# EAGLE design ir_receiver (EAGLE 7.4.0)
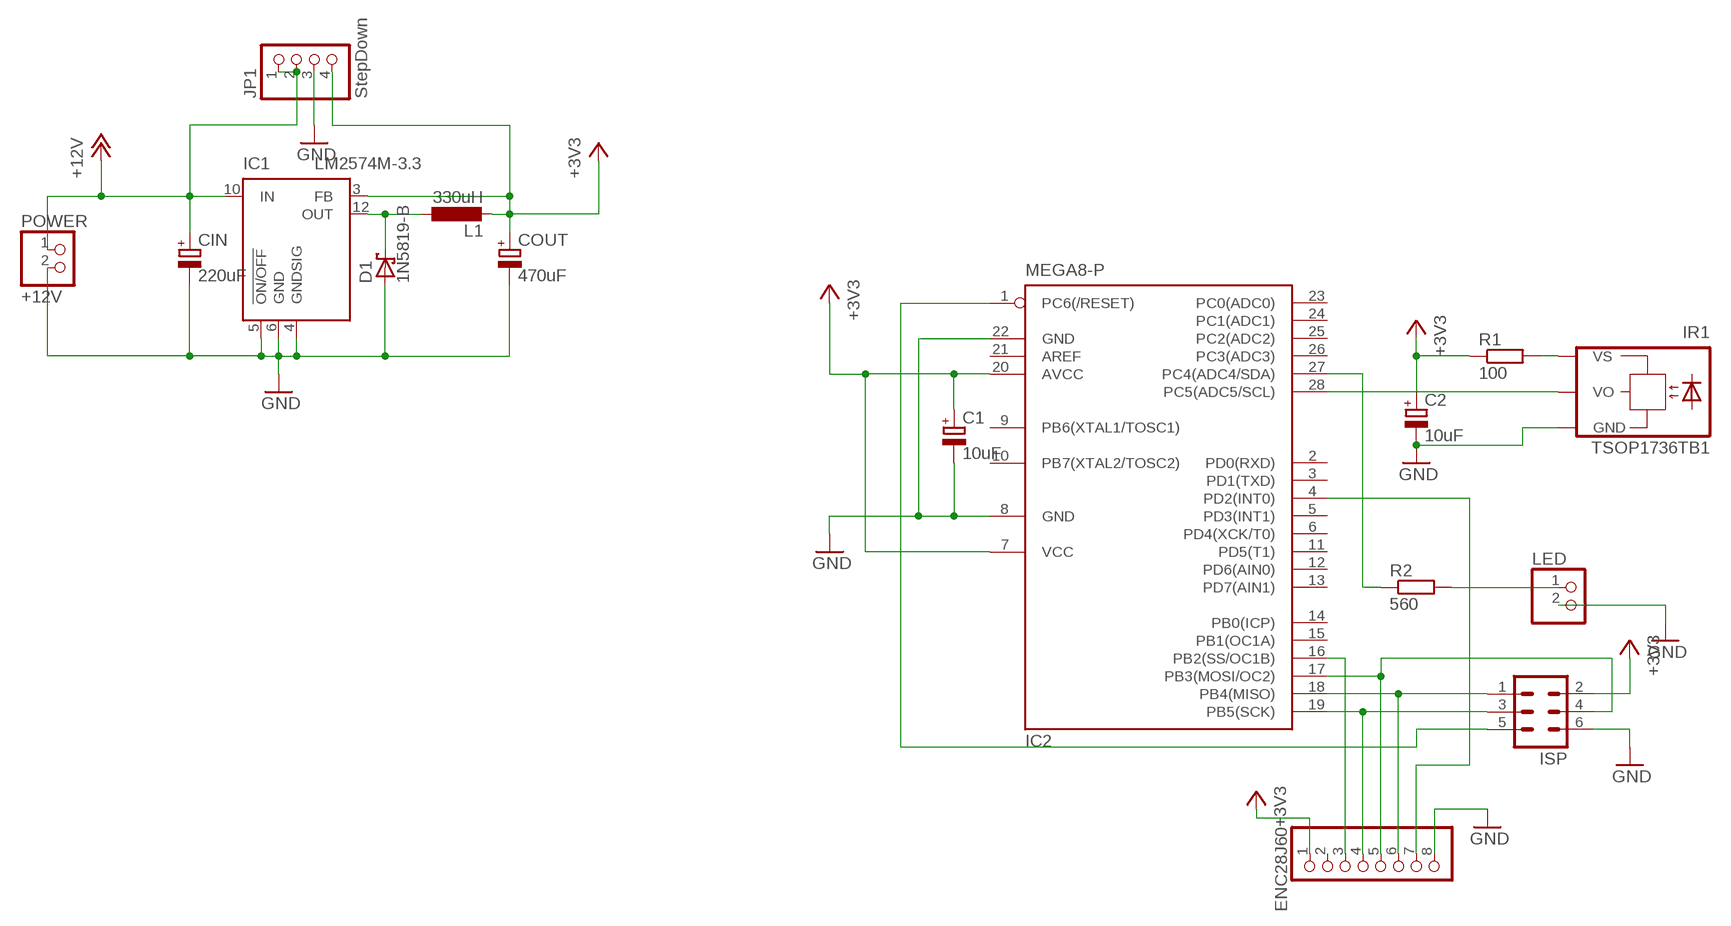
[diagram p0: schematic, sheet 1]

## Parts
C1  10uF  CPOL-EUE2.5-5  [E2,5-5]
C2  10uF  CPOL-EUE2.5-5  [E2,5-5]
CIN  220uF  CPOL-EUE3.5-8  [E3,5-8]
COUT  470uF  CPOL-EUE5-10.5  [E5-10,5]
D1  1N5819-B  [DO41-7.6]
ENC28J60  PINHD-1X8  [1X08]
IC1  LM2574M-3.3  [SO14W]
IC2  MEGA8-P  [DIL28-3]
IR1  TSOP1736TB1  [TSOP17_TB1]
ISP  ML6  [ML6]
JP1  StepDown  PINHD-1X4  [1X04]
L1  330uH  PIS4728  [PIS2816]
LED  PINHD-1X2  [1X02]
POWER  +12V  PINHD-1X2  [1X02]
R1  100  R-EU_0207/7  [0207/7]
R2  560  R-EU_0207/7  [0207/7]

## Nets
+3V3: C1.+ C2.+ COUT.+ ENC28J60.1 IC1.3(FB) IC2.7(VCC) IC2.20(AVCC) ISP.2 JP1.4 L1.2 R1.1
+12V: CIN.+ IC1.10(IN) JP1.1 JP1.2 POWER.1
GND: C1.- C2.- CIN.- COUT.- D1.A ENC28J60.8 IC1.4(GNDSIG) IC1.5(!ON/OFF) IC1.6(GND) IC2.8(GND) IC2.22(GND) IR1.GND ISP.6 JP1.3 LED.2 POWER.2
N$1: IC2.27(PC4(ADC4/SDA)) R2.1
N$2: IC2.28(PC5(ADC5/SCL)) IR1.VO
N$3: D1.C IC1.12(OUT) L1.1
N$4: LED.1 R2.2
N$5: IR1.VS R1.2
N$6: ENC28J60.4 IC2.19(PB5(SCK)) ISP.3
N$7: ENC28J60.5 IC2.17(PB3(MOSI/OC2)) ISP.4
N$8: ENC28J60.6 IC2.18(PB4(MISO)) ISP.1
N$9: IC2.1(PC6(/RESET)) ISP.5
N$10: ENC28J60.3 IC2.16(PB2(SS/OC1B))
N$11: ENC28J60.7 IC2.4(PD2(INT0))
Unconnected: ENC28J60.2 IC2.2(PD0(RXD)) IC2.3(PD1(TXD)) IC2.5(PD3(INT1)) IC2.6(PD4(XCK/T0)) IC2.9(PB6(XTAL1/TOSC1)) IC2.10(PB7(XTAL2/TOSC2)) IC2.11(PD5(T1)) IC2.12(PD6(AIN0)) IC2.13(PD7(AIN1)) IC2.14(PB0(ICP)) IC2.15(PB1(OC1A)) IC2.21(AREF) IC2.23(PC0(ADC0)) IC2.24(PC1(ADC1)) IC2.25(PC2(ADC2)) IC2.26(PC3(ADC3))

## Library data of the parts
C1 C2 CIN COUT = rcl:CPOL-EU: POLARIZED CAPACITOR, European symbol
D1 = diode:1N581*: 1.0A SCHOTTKY BARRIER RECTIFIER Source: http://www.diodes.com/datasheets/ds23001.pdf
ENC28J60 = pinhead:PINHD-1X8: PIN HEADER
IC1 = linear:LM2574?-*: SIMPLE SWITCHER 0.5A Step-Down Voltage Regulator Source: http://cache.national.com/ds/LM/LM2574.pdf
IC2 = atmel:MEGA8-P: MICROCONTROLLER 8 Kbytes FLASH, 1 kbytes SRAM, 512 bytes EEPROM, USART, 4-channel 10 bit ADC, 2-channel 8 bit ADC Pin compatible with Atmega48, ATMega88, ATMega168 Source: avr.lbr; OC_FARNELL: unknown; OC_NEWARK: unknown
IR1 = telefunken:TSOP17*TB1: TSOP17..TB1 IR Receiver Modules for Remote Control Systems Source: http://www.vishay.com/docs/82042/82042.pdf; OC_FARNELL: unknown; OC_NEWARK: unknown
ISP = con-ml:ML6: HARTING; OC_FARNELL: unknown; OC_NEWARK: unknown
JP1 = pinhead:PINHD-1X4: PIN HEADER
L1 = jbolay:PIS4728
LED POWER = pinhead:PINHD-1X2: PIN HEADER
R1 R2 = rcl:R-EU_: RESISTOR, European symbol

## Net classes
0 default: width 0.4 mm, drill 0.8 mm, clearance 0.254 mm

## Board
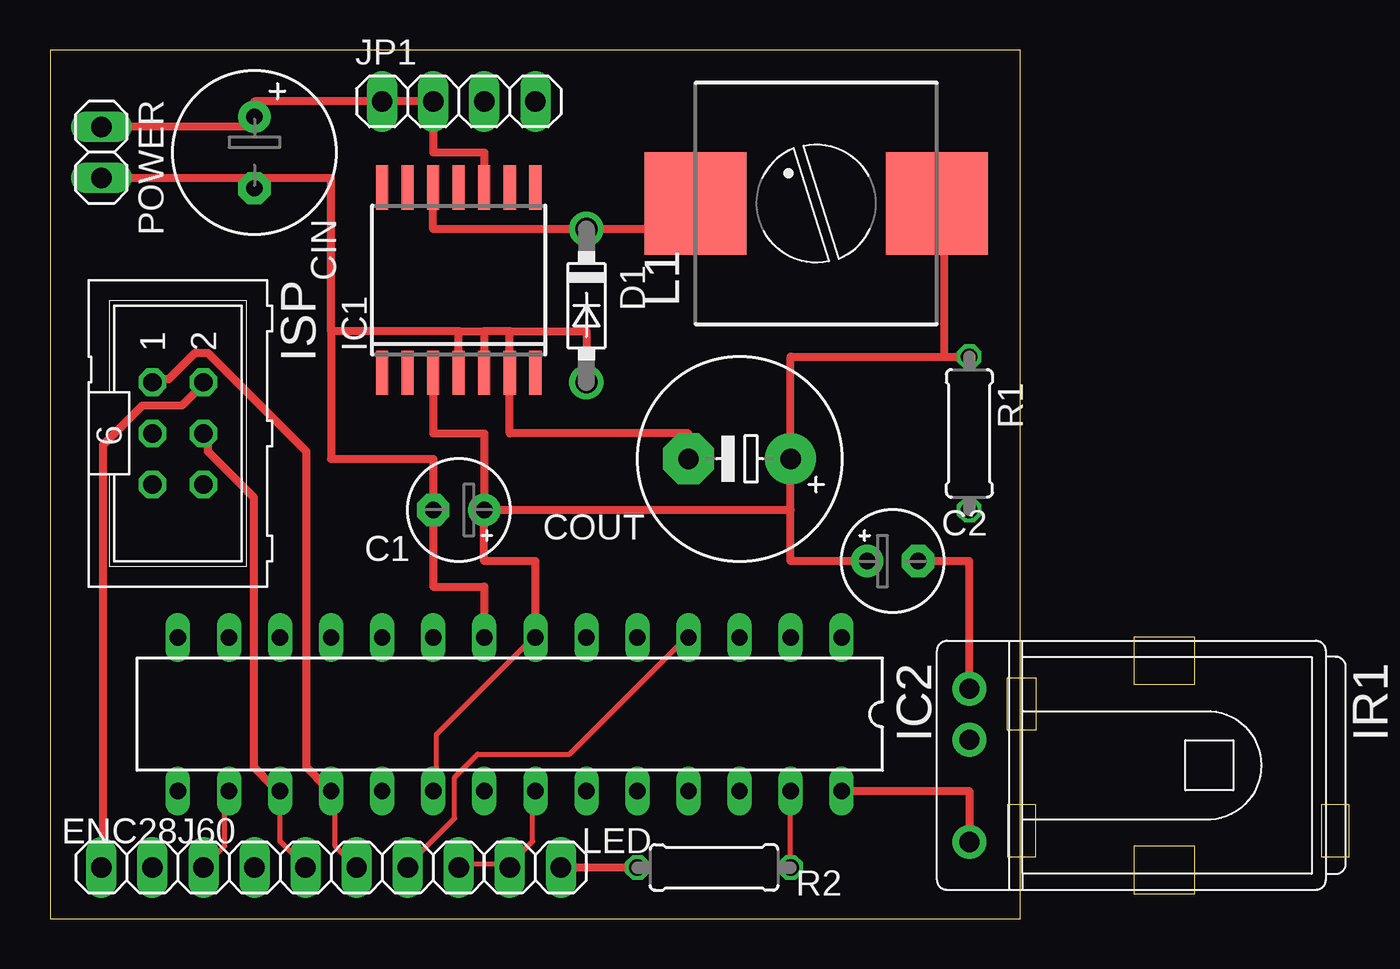
[diagram p1: board, top side]
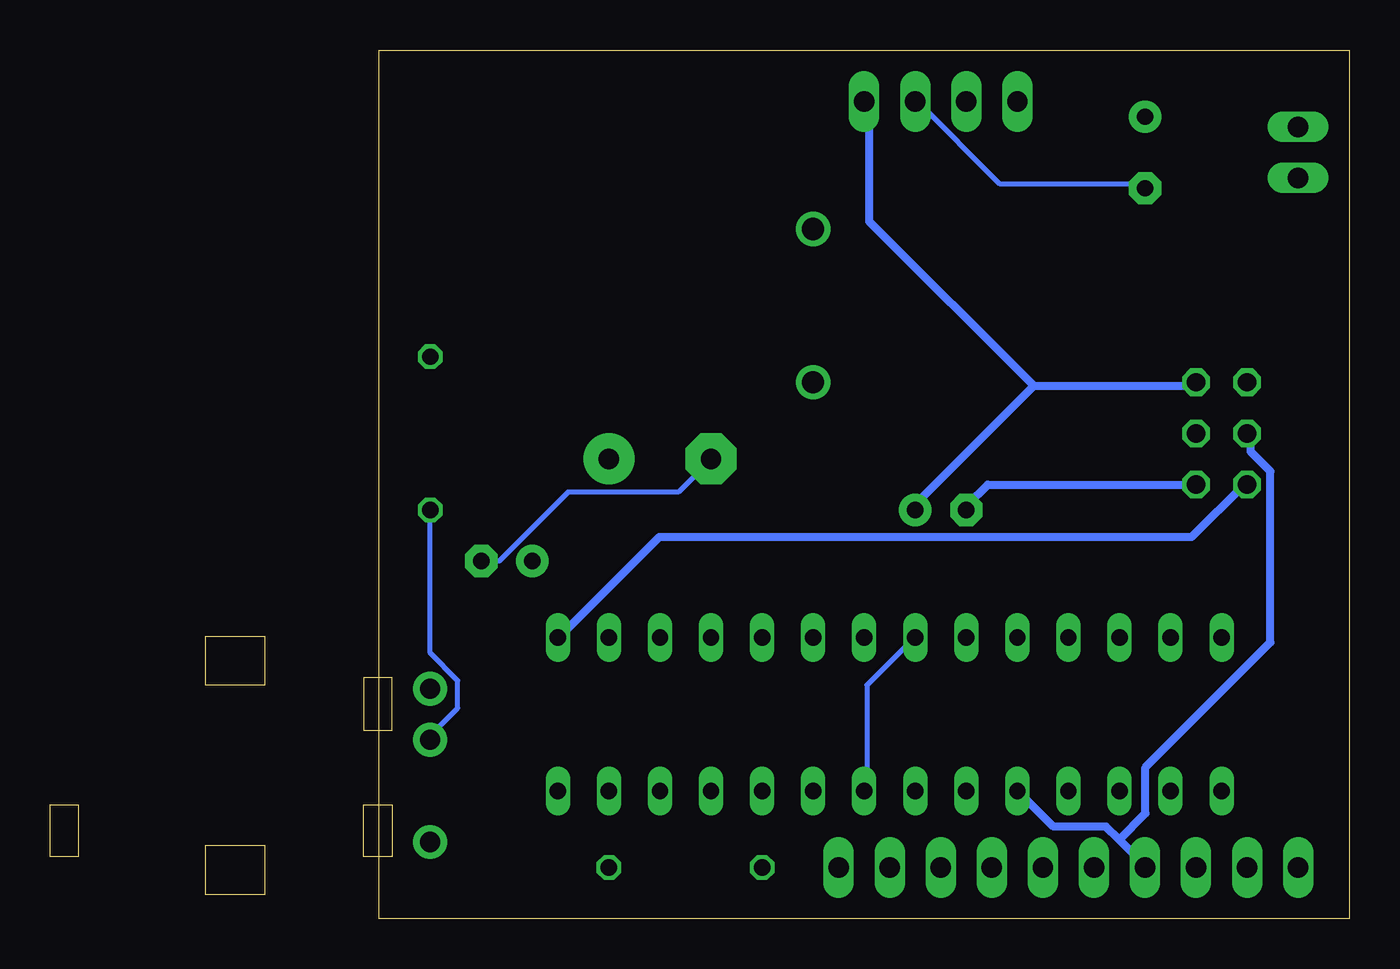
[diagram p2: board, bottom side, seen from below]

Size 48.26 x 43.18 mm. Coordinates in mm from the lower left corner, seen from the top.
Outline: 0,0 48.26,0 48.26,43.18 0,43.17 0,0
Copper layers (1*16): Top 0.035mm / dielectric 1.5mm / Bottom 0.035mm
Design rules "platinensammler_03": minimum track width 0.15mm, minimum drill 0.3mm, track to track 0.15mm, track to pad 0.15mm, pad to pad 0.15mm, via to via 0.15mm, smd to smd 0mil, copper to edge 0.2mm, drill to drill 0.2mm, minimum pad ring 0.2mm, minimum via ring 0.2mm, stop-mask expansion 2mil, vias tented up to drill 0.8mm, thermal gap 0.15mm

### Footprints (pad centres in the part's own frame; a part is rotated, then mirrored left to right if it is on the bottom)
E2,5-5 = drill 0.813 pad 1.6: + -1.27,0 | drill 0.813 pad 1.6 octagon: - 1.27,0
E3,5-8 = drill 0.813 pad 1.6: + -1.778,0 | drill 0.813 pad 1.6 octagon: - 1.778,0
E5-10,5 = drill 1.016 pad 2.54: + -2.54,0 | drill 1.016 pad 2.54 octagon: - 2.54,0
DO41-7.6 = drill 1.1 pad 1.7: A 3.81,0; C -3.81,0
1X08 = drill 1.016 long: 1 -8.89,0; 2 -6.35,0; 3 -3.81,0; 4 -1.27,0; 5 1.27,0; 6 3.81,0; 7 6.35,0; 8 8.89,0
SO14W = smd 0.6 x 2.2: 1 -3.81,-4.6; 2 -2.54,-4.6; 3 -1.27,-4.6; 4 0,-4.6; 5 1.27,-4.6; 6 2.54,-4.6; 7 3.81,-4.6; 8 3.81,4.6; 9 2.54,4.6; 10 1.27,4.6; 11 0,4.6; 12 -1.27,4.6; 13 -2.54,4.6; 14 -3.81,4.6
DIL28-3 = drill 0.813 long: 1 -16.51,-3.81; 2 -13.97,-3.81; 3 -11.43,-3.81; 4 -8.89,-3.81; 5 -6.35,-3.81; 6 -3.81,-3.81; 7 -1.27,-3.81; 8 1.27,-3.81; 9 3.81,-3.81; 10 6.35,-3.81; 11 8.89,-3.81; 12 11.43,-3.81; 13 13.97,-3.81; 14 16.51,-3.81; 15 16.51,3.81; 16 13.97,3.81; 17 11.43,3.81; 18 8.89,3.81; 19 6.35,3.81; 20 3.81,3.81; 21 1.27,3.81; 22 -1.27,3.81; 23 -3.81,3.81; 24 -6.35,3.81; 25 -8.89,3.81; 26 -11.43,3.81; 27 -13.97,3.81; 28 -16.51,3.81
TSOP17_TB1 = drill 1 pad 1.676: GND 0,-3.81; VO 0,3.81; VS 0,-1.27
ML6 = drill 0.914 octagon: 1 -2.54,-1.27; 2 -2.54,1.27; 3 0,-1.27; 4 0,1.27; 5 2.54,-1.27; 6 2.54,1.27
1X04 = drill 1.016 long: 1 -3.81,0; 2 -1.27,0; 3 1.27,0; 4 3.81,0
PIS2816 = smd 5.08 x 5.08: 1 0,6; 2 0,-6
1X02 = drill 1.016 long: 1 -1.27,0; 2 1.27,0
0207/7 = drill 0.813 octagon: 1 -3.81,0; 2 3.81,0

### Placement (x,y rotation side)
C1  20.32,20.32 180 top
C2  41.91,17.78 0 top
CIN  10.16,38.1 270 top
COUT  34.29,22.86 180 top
D1  26.67,30.48 270 top
ENC28J60  11.43,2.54 0 top
IC1  20.32,31.75 0 top
IC2  22.86,10.16 180 top
IR1  45.72,7.62 180 top
ISP  6.35,24.13 270 top
JP1  20.32,40.64 0 top
L1  38.1,35.56 90 top
LED  24.13,2.54 180 top
POWER  2.54,38.1 270 top
R1  45.72,24.13 270 top
R2  33.02,2.54 180 top

### Tracks (layer width: path | path; a pad name or v marks a point on that pad's centre or on a via)
+3V3
  Top 0.254: IC2.20 19.2,6.4 19.2,9.14 24,13.95 IC2.7
  Top 0.4: ENC28J60.1 2.62,2.62 2.62,23.54 4.58,25.51 6.54,25.51 7.52,26.49 ISP.2
  Top 0.406: IC1.3 19.05,24.13 21.59,24.13 C1.+ | C1.+ 36.83,20.32 | 36.83,20.32 COUT.+ 36.83,27.94 44.45,27.94 | 44.45,27.94 R1.1 | L1.2 44.45,35.56 44.45,27.94 | C2.+ 36.83,17.78 36.83,20.32 | IC2.7 24.13,17.78 21.59,17.78 C1.+
  Bottom 0.4: 15.7,26.49 7.85,26.49 ISP.2 | 15.7,26.49 21.58,20.6 C1.+ | 15.7,26.49 23.87,34.66 23.87,40.55 JP1.4
+12V
  Top 0.254: IC1.10 21.72,36.52 21.72,36.75 21.59,36.83 | 10.16,39.95 10.29,39.95 CIN.+
  Top 0.406: POWER.1 10.16,39.37 CIN.+ 10.16,39.95 10.16,40.64 JP1.1 JP1.2 19.05,38.1 21.59,38.1 21.59,36.83
GND
  Top 0.254: 22.86,2.69 24,3.83 24,6.35 IC2.22 | 22.86,2.69 20.34,2.69 ENC28J60.8 | 22.86,2.69 LED.2 | 10.06,36.83 10.06,36.52 CIN.- | 18.97,20.52 C1.-
  Top 0.406: POWER.2 10.06,36.83 13.97,36.83 13.97,29.21 | IC1.4 20.32,29.21 | 20.32,29.21 21.59,29.21 | 21.59,29.21 IC1.5 | 22.86,29.21 21.59,29.21 | 22.86,29.21 IC1.6 22.86,24.13 31.75,24.13 COUT.- | 22.86,29.21 26.67,29.21 D1.A | IR1.GND 45.72,17.78 C2.- | 20.32,29.21 13.97,29.21 | 13.97,29.21 13.97,22.86 19.05,22.86 C1.- 19.05,16.51 21.59,16.51 IC2.8
  Bottom 0.254: IC2.22 24,6.35 24,11.61 21.72,13.89 IC2.8 | C2.- 42.29,17.78 38.86,21.21 33.38,21.21 31.77,22.81 COUT.- | JP1.3 21.49,40.64 17.37,36.52 10.29,36.52 CIN.-
  Bottom 0.4: ISP.6 7.85,21.58 17.98,21.58 18.97,20.6 C1.-
N$1
  Top 0.254: R2.1 36.8,2.69 36.8,6.35 IC2.27
N$2
  Top 0.406: IC2.28 45.72,6.35 IR1.VO
N$3
  Top 0.254: IC1.12 19.2,36.52 19.05,36.52 | 31.75,34.29 31.77,34.47 31.77,35.15 32,35.38 L1.1
  Top 0.406: 31.75,34.29 D1.C 19.05,34.29 IC1.12 19.05,36.52 19.05,36.83
N$4
  Top 0.406: R2.2 LED.1
N$5
  Bottom 0.254: R1.2 45.72,13.21 44.35,11.84 44.35,10.46 45.72,9.09 IR1.VS
N$6
  Bottom 0.4: 11.45,3.92 10.14,2.62 ENC28J60.4 | 11.45,3.92 12.1,4.58 14.71,4.58 16.35,6.21 IC2.19 | 11.45,3.92 10.14,5.23 10.14,7.52 3.92,13.73 3.92,22.24 4.91,23.22 4.91,23.87 ISP.3
N$7
  Top 0.254: IC2.17 11.43,3.83 12.57,2.69 ENC28J60.5
  Top 0.4: ISP.4 7.85,23.87 7.85,23.22 10.14,20.93 10.14,7.52 11.12,6.54 IC2.17
N$8
  Top 0.254: ENC28J60.6 14.17,3.61 14.17,6.35 IC2.18
  Top 0.4: ISP.1 5.23,26.81 5.89,26.81 7.19,28.12 7.85,28.12 12.75,23.22 12.75,7.52 13.73,6.54 IC2.18
N$9
  Bottom 0.4: IC2.1 39.24,14.06 34.34,18.97 7.85,18.97 5.23,21.58 ISP.5
N$10
  Top 0.254: ENC28J60.3 8.69,3.61 8.69,6.35 IC2.16
N$11
  Top 0.254: IC2.4 31.55,13.89 25.83,8.18 21.26,8.18 20.12,7.04 20.12,4.98 17.83,2.69 ENC28J60.7